# EAGLE design Control Board (EAGLE 7.7.0)
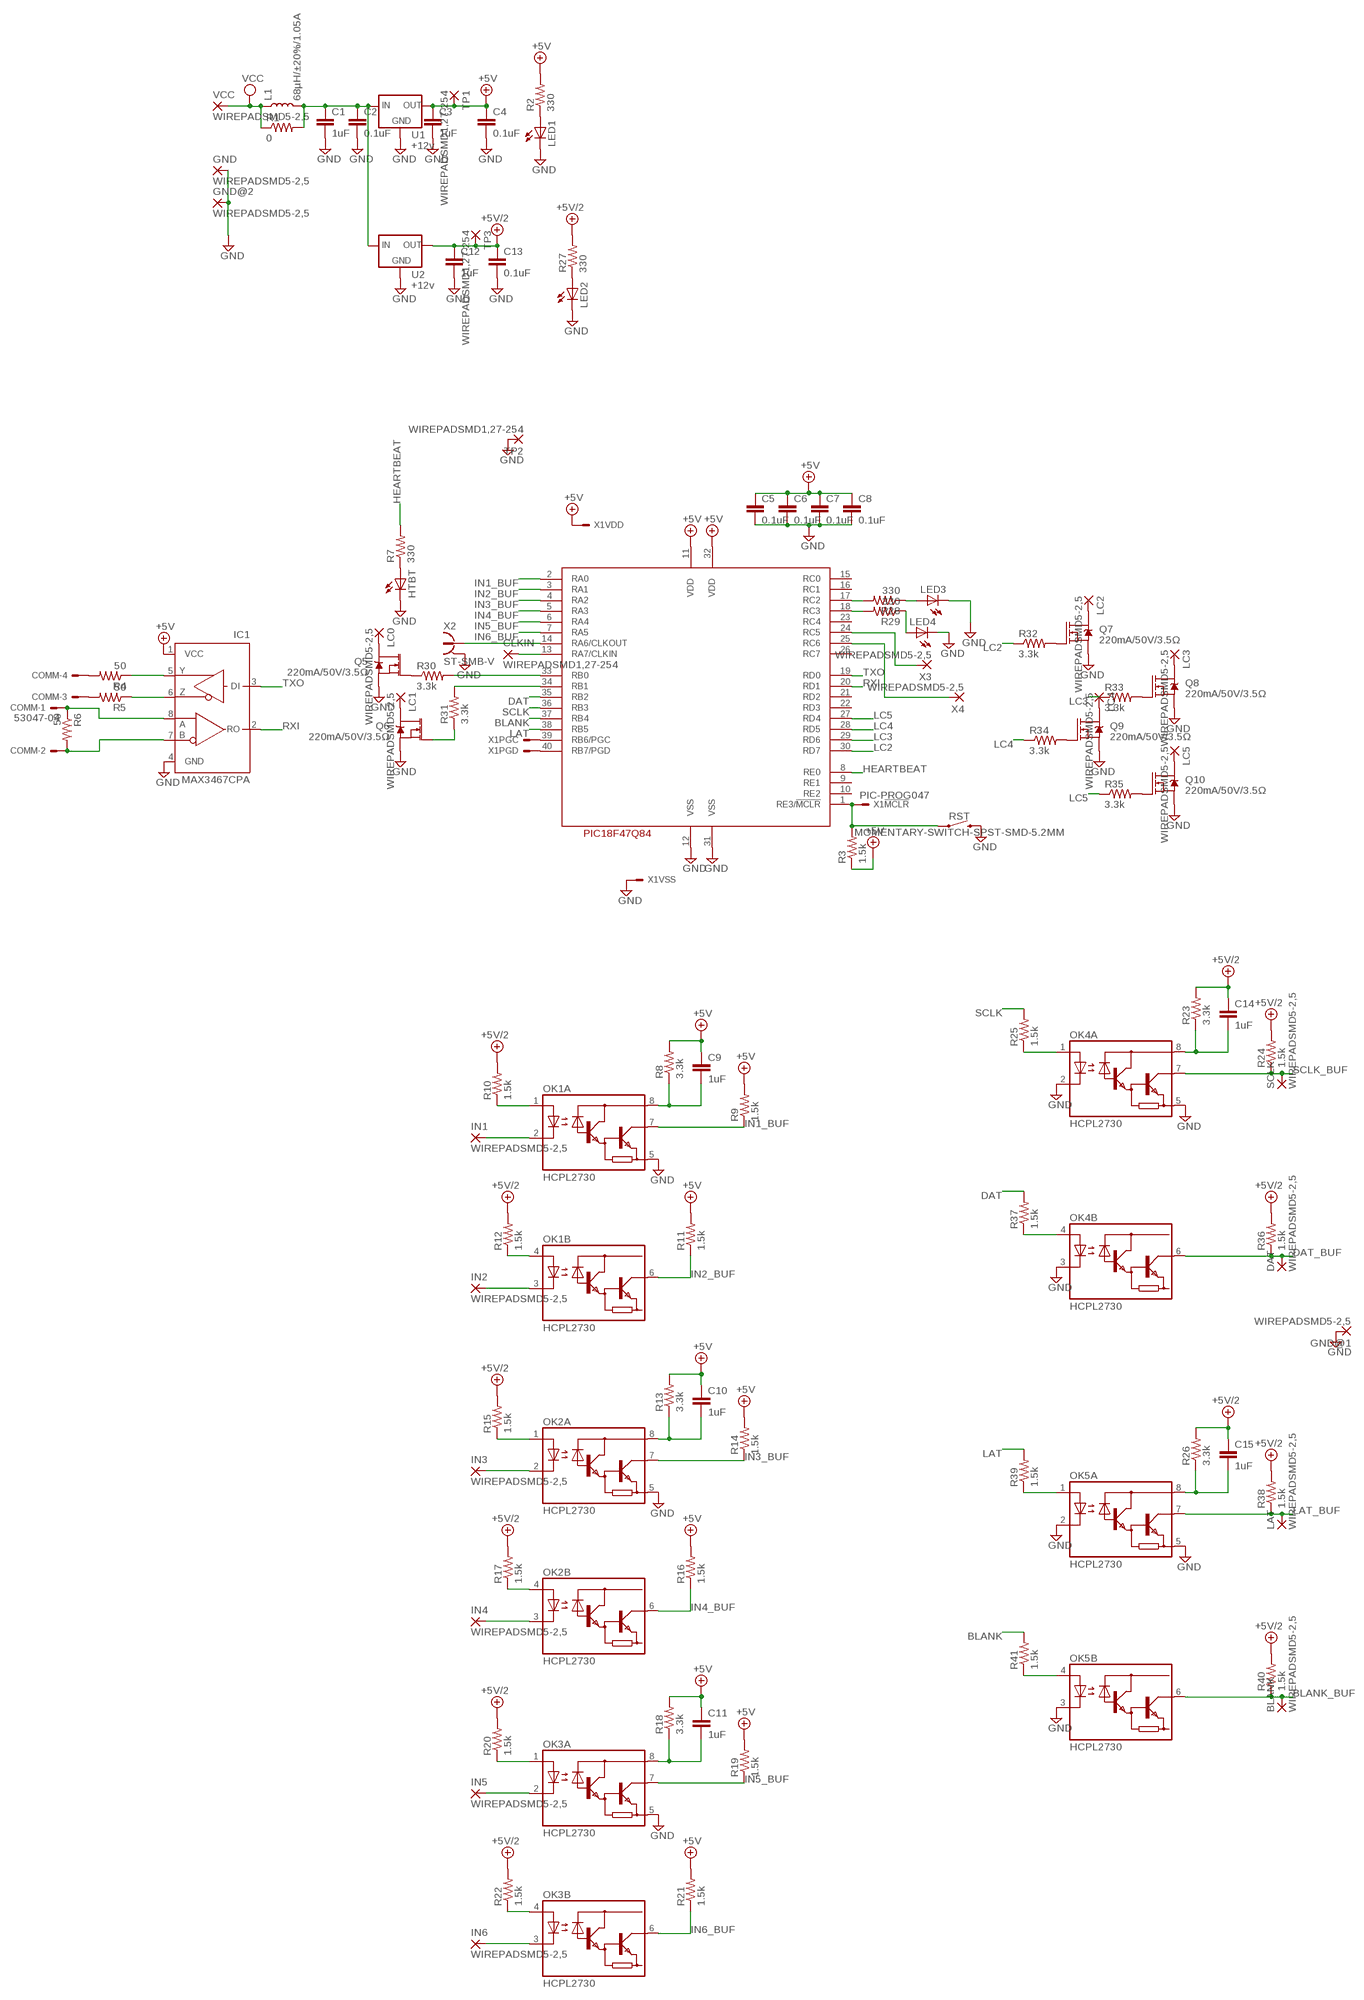
[diagram p0: schematic, sheet 1]

## Parts
BLANK  WIREPADSMD5-2,5  [5-2,5]
C1  1uF  C-EUC1206  [C1206]
C2  0.1uF  C-EUC1206  [C1206]
C3  1uF  C-EUC1206  [C1206]
C4  0.1uF  C-EUC1206  [C1206]
C5  0.1uF  C-EUC1206  [C1206]
C6  0.1uF  C-EUC1206  [C1206]
C7  0.1uF  C-EUC1206  [C1206]
C8  0.1uF  C-EUC1206  [C1206]
C9  1uF  C-EUC1206  [C1206]
C10  1uF  C-EUC1206  [C1206]
C11  1uF  C-EUC1206  [C1206]
C12  1uF  C-EUC1206  [C1206]
C13  0.1uF  C-EUC1206  [C1206]
C14  1uF  C-EUC1206  [C1206]
C15  1uF  C-EUC1206  [C1206]
CLKIN  WIREPADSMD1,27-254  [SMD1,27-2,54]
COMM  53047-04  [53047-04]
DAT  WIREPADSMD5-2,5  [5-2,5]
GND  WIREPADSMD5-2,5  [5-2,5]
GND@1  WIREPADSMD5-2,5  [5-2,5]
GND@2  WIREPADSMD5-2,5  [5-2,5]
HTBT  LEDCHIPLED_1206  [CHIPLED_1206]
IC1  MAX3467CPA  [SO08]
IN1  WIREPADSMD5-2,5  [5-2,5]
IN2  WIREPADSMD5-2,5  [5-2,5]
IN3  WIREPADSMD5-2,5  [5-2,5]
IN4  WIREPADSMD5-2,5  [5-2,5]
IN5  WIREPADSMD5-2,5  [5-2,5]
IN6  WIREPADSMD5-2,5  [5-2,5]
L1  68µH/±20%/1.05A  INDUCTOR-CR75-68UH  [CR75]
LAT  WIREPADSMD5-2,5  [5-2,5]
LC0  WIREPADSMD5-2,5  [5-2,5]
LC1  WIREPADSMD5-2,5  [5-2,5]
LC2  WIREPADSMD5-2,5  [5-2,5]
LC3  WIREPADSMD5-2,5  [5-2,5]
LC4  WIREPADSMD5-2,5  [5-2,5]
LC5  WIREPADSMD5-2,5  [5-2,5]
LED1  LEDCHIPLED_1206  [CHIPLED_1206]
LED2  LEDCHIPLED_1206  [CHIPLED_1206]
LED3  LEDCHIPLED_1206  [CHIPLED_1206]
LED4  LEDCHIPLED_1206  [CHIPLED_1206]
OK1  HCPL2730  [DIL08]
OK2  HCPL2730  [DIL08]
OK3  HCPL2730  [DIL08]
OK4  HCPL2730  [DIL08]
OK5  HCPL2730  [DIL08]
Q5  220mA/50V/3.5Ω  MOSFET-NCH-BSS138  [SOT23-3]
Q6  220mA/50V/3.5Ω  MOSFET-NCH-BSS138  [SOT23-3]
Q7  220mA/50V/3.5Ω  MOSFET-NCH-BSS138  [SOT23-3]
Q8  220mA/50V/3.5Ω  MOSFET-NCH-BSS138  [SOT23-3]
Q9  220mA/50V/3.5Ω  MOSFET-NCH-BSS138  [SOT23-3]
Q10  220mA/50V/3.5Ω  MOSFET-NCH-BSS138  [SOT23-3]
R1  0  R-US_M1206  [M1206]
R2  330  R-US_M1206  [M1206]
R3  1.5k  R-US_M1206  [M1206]
R4  50  R-US_M1206  [M1206]
R5  50  R-US_M1206  [M1206]
R6  50  R-US_M1206  [M1206]
R7  330  R-US_M1206  [M1206]
R8  3.3k  R-US_M1206  [M1206]
R9  1.5k  R-US_M1206  [M1206]
R10  1.5k  R-US_M1206  [M1206]
R11  1.5k  R-US_M1206  [M1206]
R12  1.5k  R-US_M1206  [M1206]
R13  3.3k  R-US_M1206  [M1206]
R14  1.5k  R-US_M1206  [M1206]
R15  1.5k  R-US_M1206  [M1206]
R16  1.5k  R-US_M1206  [M1206]
R17  1.5k  R-US_M1206  [M1206]
R18  3.3k  R-US_M1206  [M1206]
R19  1.5k  R-US_M1206  [M1206]
R20  1.5k  R-US_M1206  [M1206]
R21  1.5k  R-US_M1206  [M1206]
R22  1.5k  R-US_M1206  [M1206]
R23  3.3k  R-US_M1206  [M1206]
R24  1.5k  R-US_M1206  [M1206]
R25  1.5k  R-US_M1206  [M1206]
R26  3.3k  R-US_M1206  [M1206]
R27  330  R-US_M1206  [M1206]
R28  330  R-US_M1206  [M1206]
R29  330  R-US_M1206  [M1206]
R30  3.3k  R-US_M1206  [M1206]
R31  3.3k  R-US_M1206  [M1206]
R32  3.3k  R-US_M1206  [M1206]
R33  3.3k  R-US_M1206  [M1206]
R34  3.3k  R-US_M1206  [M1206]
R35  3.3k  R-US_M1206  [M1206]
R36  1.5k  R-US_M1206  [M1206]
R37  1.5k  R-US_M1206  [M1206]
R38  1.5k  R-US_M1206  [M1206]
R39  1.5k  R-US_M1206  [M1206]
R40  1.5k  R-US_M1206  [M1206]
R41  1.5k  R-US_M1206  [M1206]
RST  MOMENTARY-SWITCH-SPST-SMD-5.2MM  [TACTILE_SWITCH_SMD_5.2MM]
SCLK  WIREPADSMD5-2,5  [5-2,5]
TP1  WIREPADSMD1,27-254  [SMD1,27-2,54]
TP2  WIREPADSMD1,27-254  [SMD1,27-2,54]
TP3  WIREPADSMD1,27-254  [SMD1,27-2,54]
U1  +12v  V_REG_78XX7812  [TO-252]
U2  +12v  V_REG_78XX7812  [TO-252]
U$1  PIC18F47Q84  [DIL40]
VCC  WIREPADSMD5-2,5  [5-2,5]
X1  PIC-PROG047  [53047-05]
X2  ST-SMB-V  [ST-SMB-V]
X3  WIREPADSMD5-2,5  [5-2,5]
X4  WIREPADSMD5-2,5  [5-2,5]

## Nets
+5V: C3.1 C4.1 C5.1 C6.1 C7.1 C8.1 C9.1 C10.1 C11.1 IC1.1(VCC) R2.2 R3.1 R8.2 R9.2 R11.2 R13.2 R14.2 R16.2 R18.2 R19.2 R21.2 TP1.1(P) U1.2(OUT) U$1.11(VDD) U$1.32(VDD) X1.2
+5V/2: C12.1 C13.1 C14.1 C15.1 R10.2 R12.2 R15.2 R17.2 R20.2 R22.2 R23.2 R24.2 R26.2 R27.2 R36.2 R38.2 R40.2 TP3.1(P) U2.2(OUT)
BLANK: R41.2 U$1.37(RB4)
BLANK_BUF: BLANK.1(P) OK5.6(B:VO2) R40.1
DAT: R37.2 U$1.35(RB2)
DAT_BUF: DAT.1(P) OK4.6(B:VO2) R36.1
GND: C1.2 C2.2 C3.2 C4.2 C5.2 C6.2 C7.2 C8.2 C12.2 C13.2 GND.1(P) GND@1.1(P) GND@2.1(P) HTBT.C IC1.4(GND) LED1.C LED2.C LED3.C LED4.C OK1.5(A:GND) OK2.5(A:GND) OK3.5(A:GND) OK4.2(A:C1) OK4.3(B:C2) OK4.5(A:GND) OK5.2(A:C1) OK5.3(B:C2) OK5.5(A:GND) Q5.2(S) Q6.2(S) Q7.2(S) Q8.2(S) Q9.2(S) Q10.2(S) RST.3 TP2.1(P) U1.3(GND) U2.3(GND) U$1.12(VSS) U$1.31(VSS) X1.3 X2.2 X2.3 X2.4 X2.5
HEARTBEAT: R7.2 U$1.8(RE0)
IN1: IN1.1(P) OK1.2(A:C1)
IN1_BUF: OK1.7(A:VO1) R9.1 U$1.2(RA0)
IN2: IN2.1(P) OK1.3(B:C2)
IN2_BUF: OK1.6(B:VO2) R11.1 U$1.3(RA1)
IN3: IN3.1(P) OK2.2(A:C1)
IN3_BUF: OK2.7(A:VO1) R14.1 U$1.4(RA2)
IN4: IN4.1(P) OK2.3(B:C2)
IN4_BUF: OK2.6(B:VO2) R16.1 U$1.5(RA3)
IN5: IN5.1(P) OK3.2(A:C1)
IN5_BUF: OK3.7(A:VO1) R19.1 U$1.6(RA4)
IN6: IN6.1(P) OK3.3(B:C2)
IN6_BUF: OK3.6(B:VO2) R21.1 U$1.7(RA5)
LAT: R39.2 U$1.38(RB5)
LAT_BUF: LAT.1(P) OK5.7(A:VO1) R38.1
LC2: R32.1 U$1.30(RD7)
LC3: R33.1 U$1.29(RD6)
LC4: R34.1 U$1.28(RD5)
LC5: R35.1 U$1.27(RD4)
N$1: C1.1 C2.1 L1.P$2 R1.2 U1.1(IN) U2.1(IN)
N$2: LED1.A R2.1
N$3: R3.2 RST.1 U$1.1(RE3/!MCLR) X1.1
N$4: U$1.40(RB7/PGD) X1.4
N$5: U$1.39(RB6/PGC) X1.5
N$6: U$1.14(RA6/CLKOUT) X2.1
N$7: IC1.5(Y) R4.1
N$8: IC1.6(Z) R5.1
N$9: COMM.1 IC1.8(A) R6.1
N$10: COMM.2 IC1.7(B) R6.2
N$11: COMM.4 R4.2
N$12: COMM.3 R5.2
N$13: HTBT.A R7.1
N$14: CLKIN.1(P) U$1.13(RA7/CLKIN)
N$15: C9.2 OK1.8(A:VCC) R8.1
N$16: C10.2 OK2.8(A:VCC) R13.1
N$17: OK2.1(A:A1) R15.1
N$18: OK1.1(A:A1) R10.1
N$19: OK2.4(B:A2) R17.1
N$20: OK1.4(B:A2) R12.1
N$21: C11.2 OK3.8(A:VCC) R18.1
N$22: OK3.1(A:A1) R20.1
N$23: OK3.4(B:A2) R22.1
N$24: C14.2 OK4.8(A:VCC) R23.1
N$25: OK4.1(A:A1) R25.1
N$26: C15.2 OK5.8(A:VCC) R26.1
N$27: OK4.4(B:A2) R37.1
N$28: OK5.1(A:A1) R39.1
N$29: LED2.A R27.1
N$30: OK5.4(B:A2) R41.1
N$33: R28.2 U$1.17(RC2)
N$34: R29.2 U$1.18(RC3)
N$35: LED3.A R28.1
N$36: LED4.A R29.1
N$37: R30.2 U$1.33(RB0)
N$38: R31.2 U$1.34(RB1)
N$39: Q5.1(G) R30.1
N$40: Q6.1(G) R31.1
N$41: LC0.1(P) Q5.3(D)
N$42: LC1.1(P) Q6.3(D)
N$43: Q7.1(G) R32.2
N$44: Q8.1(G) R33.2
N$45: Q9.1(G) R34.2
N$46: Q10.1(G) R35.2
N$47: LC2.1(P) Q7.3(D)
N$48: LC3.1(P) Q8.3(D)
N$49: LC4.1(P) Q9.3(D)
N$50: LC5.1(P) Q10.3(D)
N$51: U$1.25(RC6) X4.1(P)
N$52: U$1.24(RC5) X3.1(P)
RXI: IC1.2(RO) U$1.20(RD1)
SCLK: R25.2 U$1.36(RB3)
SCLK_BUF: OK4.7(A:VO1) R24.1 SCLK.1(P)
TXO: IC1.3(DI) U$1.19(RD0)
VCC: L1.P$1 R1.1 VCC.1(P)
Unconnected: U$1.9(RE1) U$1.10(RE2) U$1.15(RC0) U$1.16(RC1) U$1.21(RD2) U$1.22(RD3) U$1.23(RC4) U$1.26(RC7)

## Library data of the parts
BLANK CLKIN DAT GND GND@1 GND@2 IN1-IN6 LAT LC0 LC1-LC5 SCLK TP1-TP3 VCC X3 X4 = wirepad:WIREPAD: Wire PAD connect wire on PCB
C1-C15 = resistor:C-EU: CAPACITOR, European symbol
COMM = con-molex:53?-04: CONNECTOR wire to board 1.25 mm (.049 inch) pitch header; MF: WALDOM/MOLEX; MPN: 53047-0410; OC_FARNELL: 9733060; OC_NEWARK: 38C9900
HTBT LED1-LED4 = led:LED: LED OSRAM: - CHIPLED LG R971, LG N971, LY N971, LG Q971, LY Q971, LO R971, LY R971 LH N974, LH R974 LS Q976, LO Q976, LY Q976 LO Q996 - Hyper CHIPLED LW Q18S LB Q993, LB Q99A, LB R99A - SideLED LS A670, LO A670, LY A670, LG A670, LP A670 LB A673, LV A673, LT A673, LW A673 LH A674 LY A675 LS A676, LA A676, LO A676, LY A676, LW A676 LS A679, LY A679, LG A679 - Hyper Micro SIDELED® LS Y876, LA Y876, LO Y876, LY Y876 LT Y87S - SmartLED LW L88C, LW L88S LB L89C, LB L89S, LG L890 LS L89K, LO L89K, LY L89K LS L896, LA L896, LO L896, LY L896 - TOPLED LS T670, LO T670, LY T670, LG T670, LP T670 LSG T670, LSP T670, LSY T670, LOP T670, LYG T670 LG T671, LOG T671, LSG T671 LB T673, LV T673, LT T673, LW T673 LH T674 LS T676, LA T676, LO T676, LY T676, LB T676, LH T676, LSB T676, LW T676 LB T67C, LV T67C, LT T67C, LS T67K, LO T67K, LY T67K, LW E67C LS E67B, LA E67B, LO E67B, LY E67B, LB E67C, LV E67C, LT E67C LW T67C LS T679, LY T679, LG T679 LS T770, LO T770, LY T770, LG T770, LP T770 LB T773, LV T773, LT T773, LW T773 LH T774 LS E675, LA E675, LY E675, LS T675 LS T776, LA T776, LO T776, LY T776, LB T776 LHGB T686 LT T68C, LB T68C - Hyper Mini TOPLED® LB M676 - Mini TOPLED Santana® LG M470 LS M47K, LO M47K, LY M47K Source: http://www.osram.convergy.de LUXEON: - LUMILED® LXK2-PW12-R00, LXK2-PW12-S00, LXK2-PW14-U00, LXK2-PW14-V00 LXK2-PM12-R00, LXK2-PM12-S00, LXK2-PM14-U00 LXK2-PE12-Q00, LXK2-PE12-R00, LXK2-PE12-S00, LXK2-PE14-T00, LXK2-PE14-U00 LXK2-PB12-K00, LXK2-PB12-L00, LXK2-PB12-M00, LXK2-PB14-N00, LXK2-PB14-P00, LXK2-PB14-Q00 LXK2-PR12-L00, LXK2-PR12-M00, LXK2-PR14-Q00, LXK2-PR14-R00 LXK2-PD12-Q00, LXK2-PD12-R00, LXK2-PD12-S00 LXK2-PH12-R00, LXK2-PH12-S00 LXK2-PL12-P00, LXK2-PL12-Q00, LXK2-PL12-R00 Source: www.luxeon.com KINGBRIGHT: KA-3528ASYC Source: www.kingbright.com
IC1 = maxim:MAX3467*: +5V, Fail-Safe, 40Mbps, Profibus RS-485/RS-422 Transceivers Source: MAX3465-MAX3469.pdf; OC_FARNELL: unknown; OC_NEWARK: unknown
L1 = SparkFun-Coils:INDUCTOR: Inductors Resist changes in electrical current. Basically a coil of wire. SparkFun Products: SparkFun Load Cell Amplifier - HX711 <https://www.sparkfun.com/products/13879> IOIO-OTG - V2.2 <https://www.sparkfun.com/products/13613>; PROD_ID: NDUC-09739
OK1-OK5 = optocoupler:HCPL2730: HEWLETT PACKARD OPTO COUPLER; MF: AGILENT TECHNOLOGIES; MPN: HCPL-2730-000E; OC_FARNELL: 9994840; OC_NEWARK: 88H7816
Q5-Q10 = SparkFun-DiscreteSemi:MOSFET-NCH: N-channel MOSFETs Voltage controlled devices that allow control of high current outputs. SparkFun Products: SparkFun OpenScale <https://www.sparkfun.com/products/13261> SparkFun Digital Sandbox <https://www.sparkfun.com/products/12651> SparkFun Monster Moto Shield <https://www.sparkfun.com/products/10182> SparkFun MOSFET Power Controller <https://www.sparkfun.com/products/11214>; PROD_ID: TRANS-00830
R1-R41 = resistor:R-US_: RESISTOR, American symbol
RST = SparkFun-Switches:MOMENTARY-SWITCH-SPST: Momentary Switch (Pushbutton) - SPST Normally-open (NO) SPST momentary switches (buttons, pushbuttons). Variants PTH-12MM - 12mm square, through-hole Momentary Pushbutton Switch - 12mm Square <https://www.sparkfun.com/products/9190> (COM-09190) PTH-6.0MM, PTH-6.0MM-KIT - 6.0mm square, through-hole Mini Pushbutton Switch <https://www.sparkfun.com/products/97> (COM-00097) KIT package intended for soldering kit's - only one side of pads' copper is exposed. PTH-RIGHT-ANGLE-KIT - Right-angle, through-hole Right Angle Tactile Button <https://www.sparkfun.com/products/10791> - Used on SparkFun BigTime Watch Kit <https://www.sparkfun.com/products/11734> SMD-12MM - 12mm square, surface-mount Tactile Button - SMD (12mm) <https://www.sparkfun.com/products/12993> (COM-12993) Used on SparkFun PicoBoard <https://www.sparkfun.com/products/11888> SMD-4.5MM - 4.5mm Square Trackball Switch Used on SparkFun Blackberry Trackballer Breakout <https://www.sparkfun.com/products/13169> SMD-4.6MMX2.8MM - 4.60mm x 2.80mm, surface mount Used on SparkFun SAMD21 Mini Breakout <https://www.sparkfun.com/products/13664> SMD-5.2MM, SMD-5.2-REDUNDANT - 5.2mm square, surface-mount Mini Pushbutton Switch - SMD <https://www.sparkfun.com/products/8720> (COM-08720) Used on Arduino Pro Mini <https://www.sparkfun.com/products/11114> REDUNDANT package connects both switch circuits together SMD-6.0X3.5MM - 6.0 x 3.5mm, surface mount Momentary Reset Switch SMD <https://www.sparkfun.com/products/8229> (COM-08229) SMD-6.2MM-TALL - 6.2mm square, surface mount Tactile Button - SMD (6mm) <https://www.sparkfun.com/products/12992> Used on SparkFun Digital Sandbox <https://www.sparkfun.com/products/12651> SMD-RIGHT-ANGLE - Right-angle, surface mount Used on SparkFun Block for Intel® Edison - Arduino <https://www.sparkfun.com/products/13036>; PROD_ID: SWCH-08247; SF_SKU: COM-08720
U1 U2 = SparkFun-IC-Power:V_REG_78XX: Voltage Regulator Standard 78xx regulator. IGO (Input Ground Output). Spark Fun Electronics SKU : COM-00107; PROD_ID: VREG-12370
U$1 = FRC696:PIC18F47Q84
X1 = FRC696:PIC-PROG: CONNECTOR wire to board 1.25 mm (.049 inch) pitch header; MF: MOLEX; MPN: 53047-0510; OC_FARNELL: 9732861; OC_NEWARK: 38C9901
X2 = con-coax:ST-SMB-V: MALE SMB CONNECTOR Radiall distributor RS 193-8855G7; OC_FARNELL: unknown; OC_NEWARK: unknown

## Board
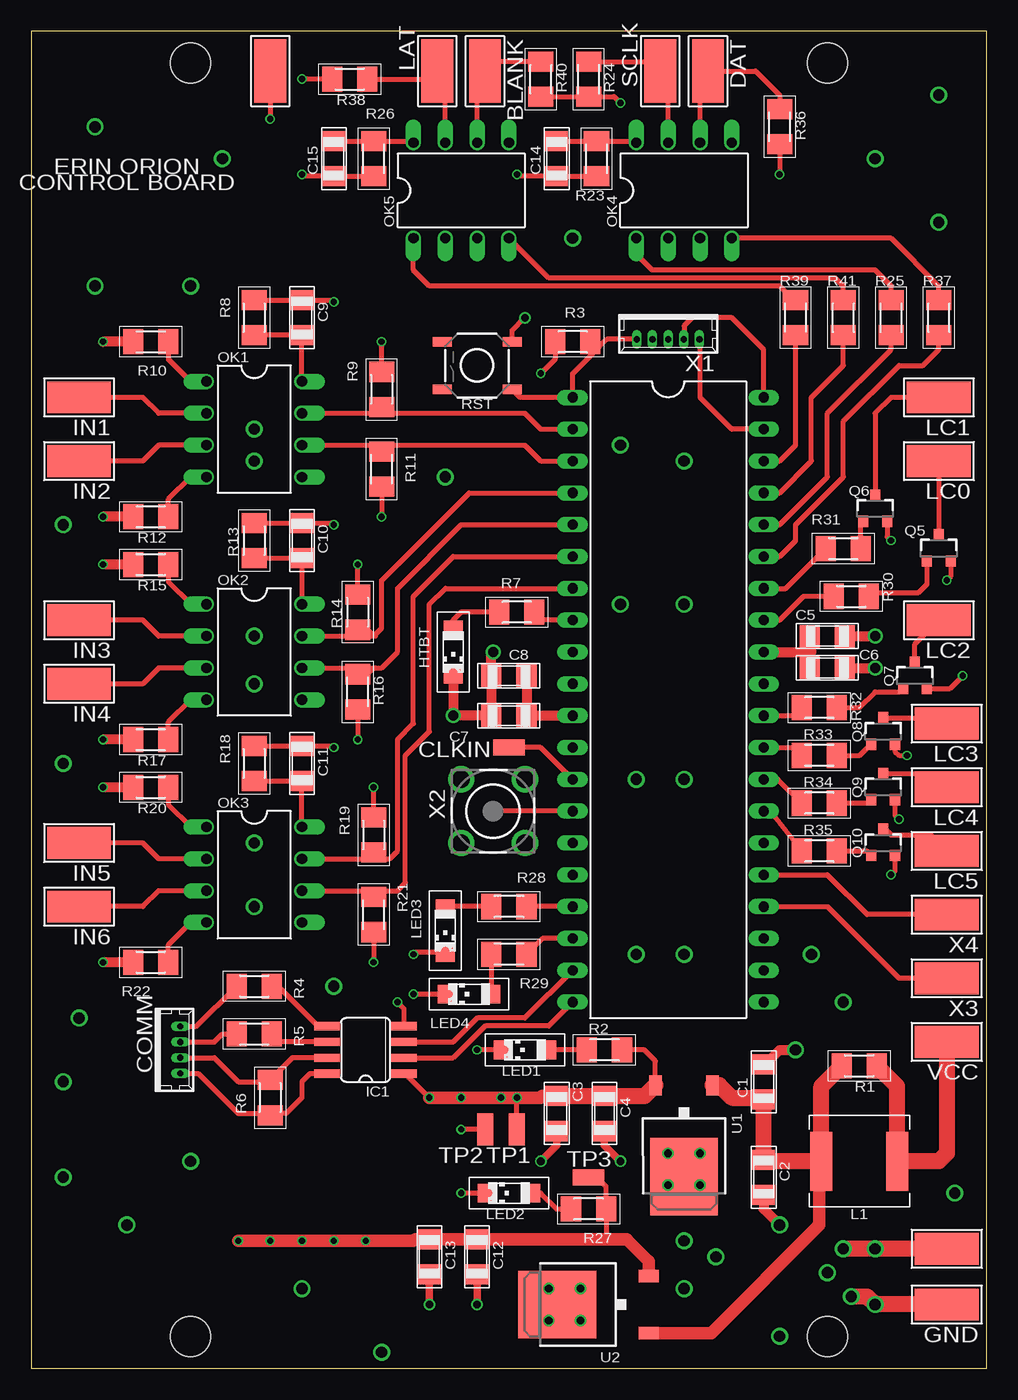
[diagram p1: board, top side]
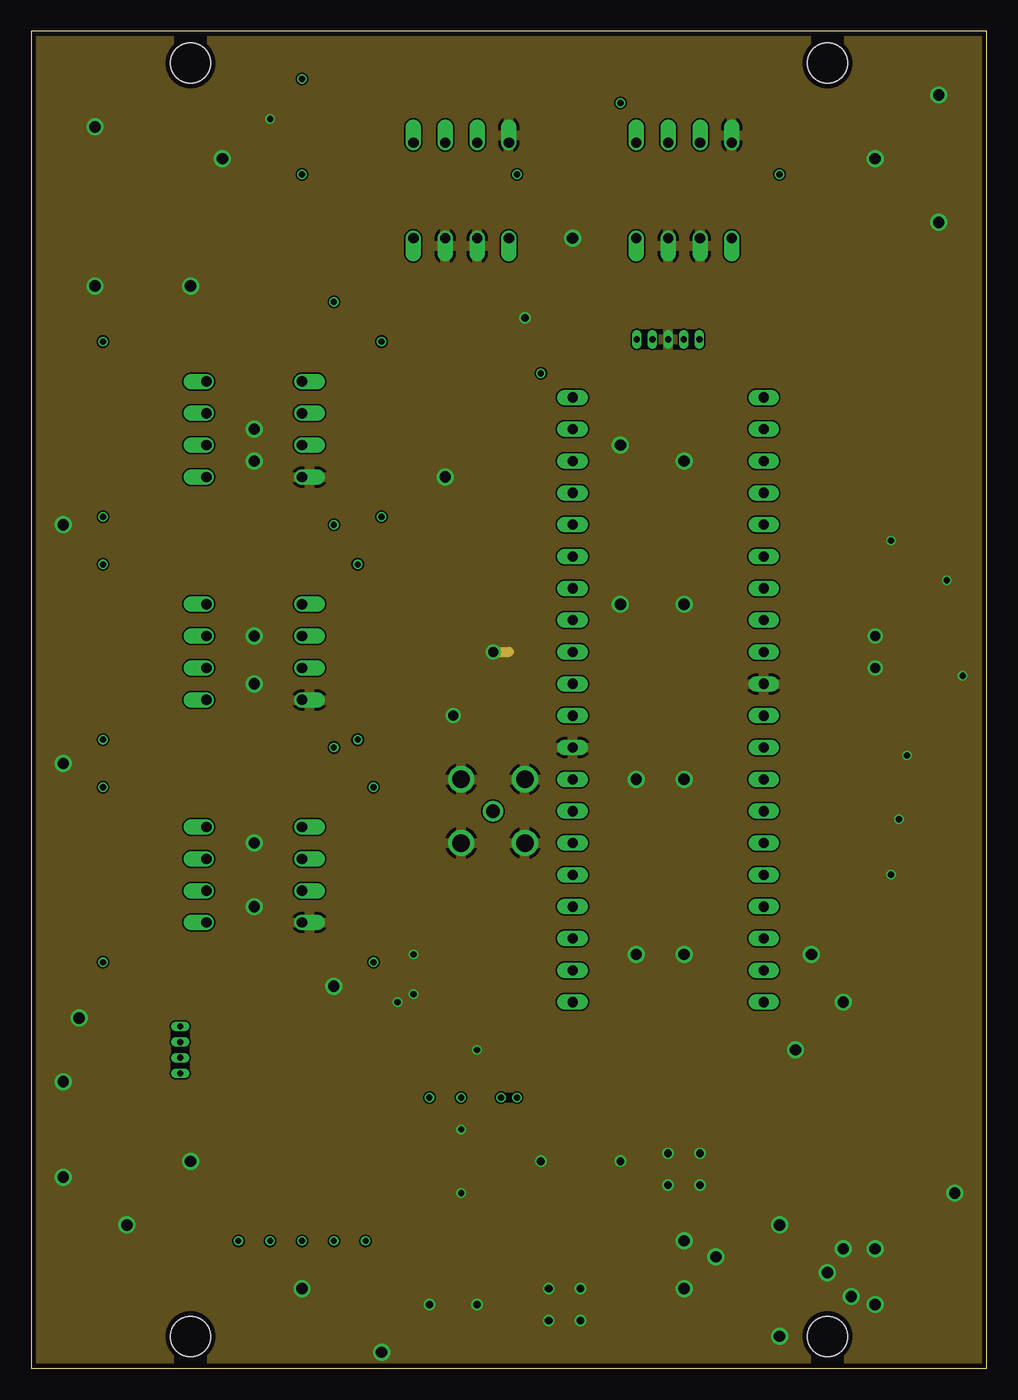
[diagram p2: board, inner layer Route2]
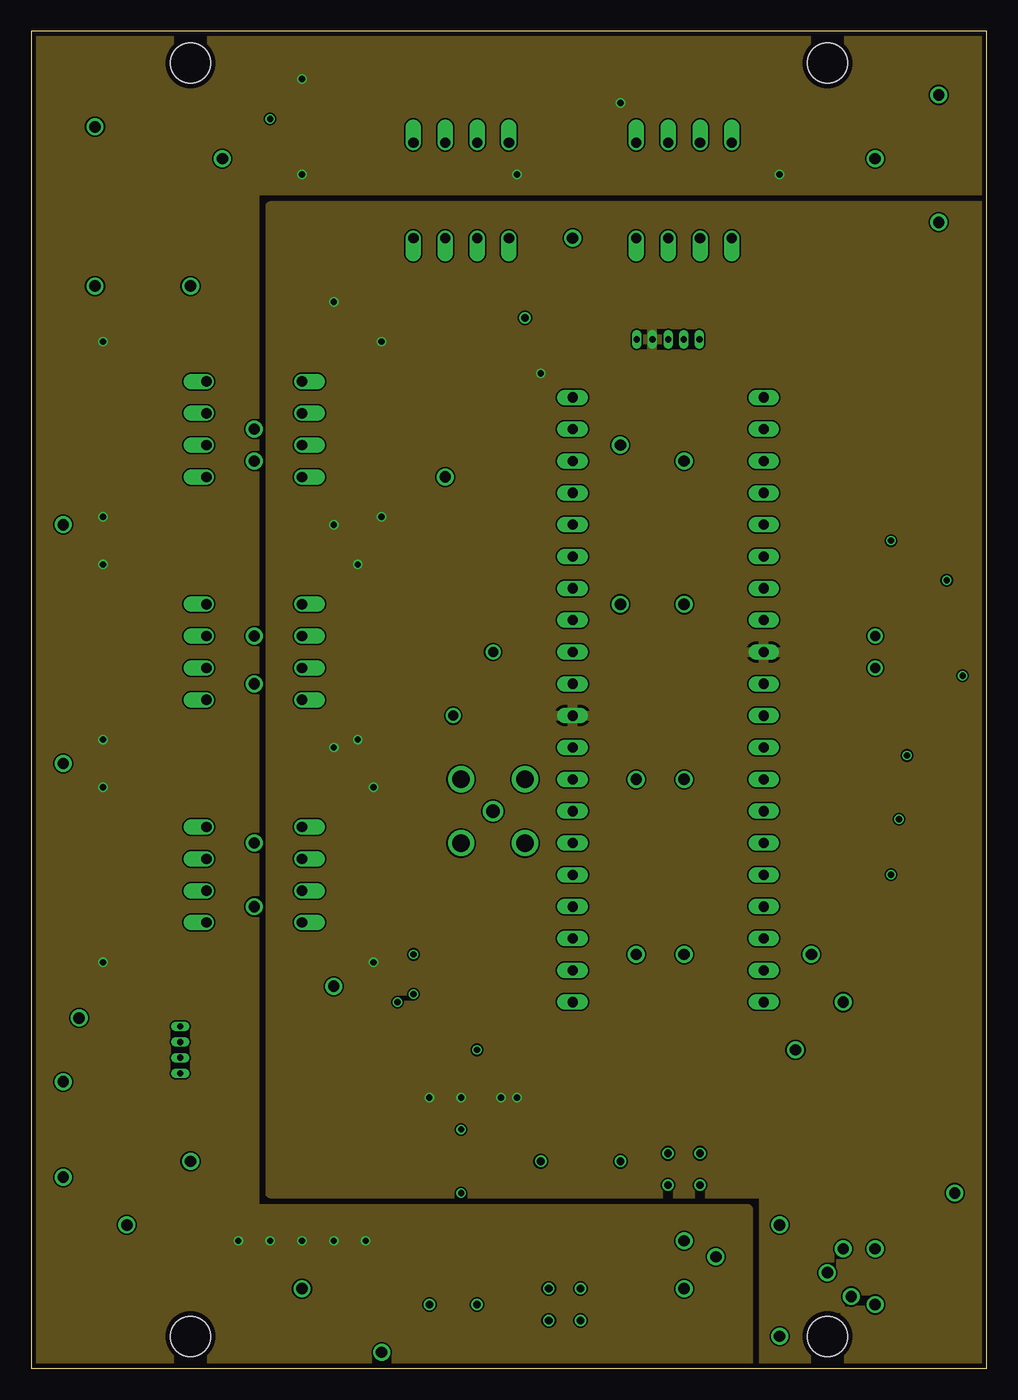
[diagram p3: board, inner layer Route15]
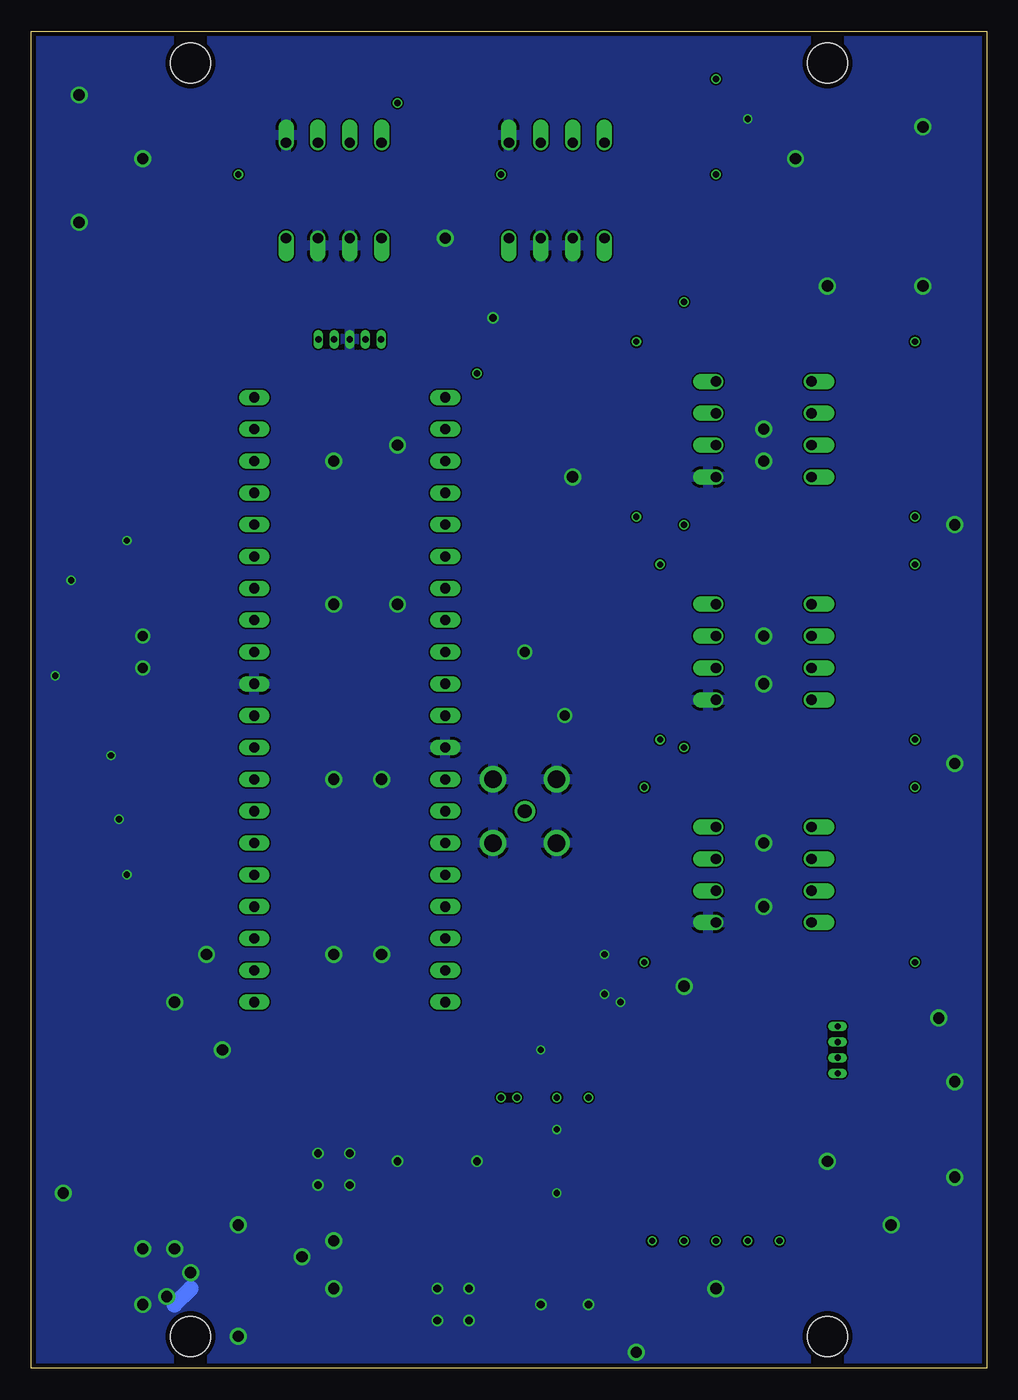
[diagram p4: board, bottom side, seen from below]

Size 76.2 x 106.68 mm. Coordinates in mm from the lower left corner, seen from the top.
Outline: 0,0 76.2,0 76.2,106.68 0,106.68 0,0
Copper layers (1*2*15*16): Top 0.035559375mm / dielectric 0.17018125mm / Route2 0.01778125mm / dielectric 47mil / Route15 0.01778125mm / dielectric 0.17018125mm / Bottom 0.035559375mm
Design rules "oshpark-4layer": minimum track width 5mil, minimum drill 10mil, track to track 5mil, track to pad 5mil, pad to pad 5mil, via to via 5mil, smd to smd 5mil, copper to edge 15mil, drill to drill 6mil, minimum pad ring 4mil, minimum via ring 4mil, stop-mask expansion 1.5mil, vias tented up to drill 0mil, thermal gap 10mil
Holes 3.2 mm at 12.7,2.54 63.5,2.54 12.7,104.14 63.5,104.14

### Footprints (pad centres in the part's own frame; a part is rotated, then mirrored left to right if it is on the bottom)
5-2,5 = smd 2.54 x 5.08: 1 0,0
C1206 = smd 1.6 x 1.8: 1 -1.4,0; 2 1.4,0
SMD1,27-2,54 = smd 1.27 x 2.54: 1 0,0
53047-04 = drill 0.5 pad 0.698 long: 1 1.875,0.45; 2 0.625,0.45; 3 -0.625,0.45; 4 -1.875,0.45
CHIPLED_1206 = smd 1.5 x 1.5: A 0,-1.75; C 0,1.75
SO08 = smd 0.66 x 2.032: 1 -1.905,-3.073; 2 -0.635,-3.073; 3 0.635,-3.073; 4 1.905,-3.073; 5 1.905,3.073; 6 0.635,3.073; 7 -0.635,3.073; 8 -1.905,3.073
CR75 = smd 1.75 x 4.7: P$1 -3.025,0; P$2 3.025,0
DIL08 = drill 0.813 offset: 1 -3.81,-3.81; 2 -1.27,-3.81; 3 1.27,-3.81; 4 3.81,-3.81; 5 3.81,3.81; 6 1.27,3.81; 7 -1.27,3.81; 8 -3.81,3.81
SOT23-3 = smd 0.8 x 0.9: 1 -0.95,-1; 2 0.95,-1; 3 0,1.1
M1206 = smd 1.6 x 2: 1 -1.4,0; 2 1.4,0
TACTILE_SWITCH_SMD_5.2MM = smd 1.524 x 0.762: 1 -2.794,1.905; 2 2.794,1.905; 3 -2.794,-1.905; 4 2.794,-1.905
TO-252 = smd 1 x 1.6: 1 -2.28,-4.8; 2 2.28,-4.8 | smd 5.4 x 6.2: 3 0,2.5
DIL40 = drill 0.813 long: 1 -24.13,-7.62; 2 -21.59,-7.62; 3 -19.05,-7.62; 4 -16.51,-7.62; 5 -13.97,-7.62; 6 -11.43,-7.62; 7 -8.89,-7.62; 8 -6.35,-7.62; 9 -3.81,-7.62; 10 -1.27,-7.62; 11 1.27,-7.62; 12 3.81,-7.62; 13 6.35,-7.62; 14 8.89,-7.62; 15 11.43,-7.62; 16 13.97,-7.62; 17 16.51,-7.62; 18 19.05,-7.62; 19 21.59,-7.62; 20 24.13,-7.62; 21 24.13,7.62; 22 21.59,7.62; 23 19.05,7.62; 24 16.51,7.62; 25 13.97,7.62; 26 11.43,7.62; 27 8.89,7.62; 28 6.35,7.62; 29 3.81,7.62; 30 1.27,7.62; 31 -1.27,7.62; 32 -3.81,7.62; 33 -6.35,7.62; 34 -8.89,7.62; 35 -11.43,7.62; 36 -13.97,7.62; 37 -16.51,7.62; 38 -19.05,7.62; 39 -21.59,7.62; 40 -24.13,7.62
53047-05 = drill 0.5 pad 0.698 long: 1 2.5,0.45; 2 1.25,0.45; 3 0,0.45; 4 -1.25,0.45; 5 -2.5,0.45
ST-SMB-V = drill 1.1: 1 0,0 | drill 1.4: 2 -2.54,2.54; 3 2.54,2.54; 4 2.54,-2.54; 5 -2.54,-2.54

### Placement (x,y rotation side)
BLANK  36.2,103.5 0 top
C1  58.42,22.86 90 top
C2  58.42,15.24 270 top
C3  41.91,20.32 270 top
C4  45.72,20.32 270 top
C5  63.5,58.42 0 top
C6  63.5,55.88 0 top
C7  38.1,52.07 180 top
C8  38.1,55.24 180 top
C9  21.59,83.82 270 top
C10  21.59,66.04 270 top
C11  21.59,48.26 270 top
C12  35.56,8.89 270 top
C13  31.75,8.89 270 top
C14  41.91,96.52 90 top
C15  24.13,96.52 90 top
CLKIN  38.1,49.53 90 top
COMM  11.43,25.4 270 top
DAT  53.98,103.5 0 top
GND  73.03,9.53 90 top
GND@1  19.05,103.5 0 top
GND@2  73.03,5.08 90 top
HTBT  33.66,57.15 180 top
IC1  26.67,25.4 90 top
IN1  3.81,77.47 90 top
IN2  3.81,72.39 90 top
IN3  3.81,59.69 90 top
IN4  3.81,54.61 90 top
IN5  3.81,41.91 90 top
IN6  3.81,36.83 90 top
L1  66.04,16.51 180 top
LAT  32.38,103.5 0 top
LC0  72.39,72.39 90 top
LC1  72.39,77.47 90 top
LC2  72.39,59.69 90 top
LC3  73.03,51.44 90 top
LC4  73.03,46.35 90 top
LC5  73.03,41.27 90 top
LED1  39.37,25.4 90 top
LED2  38.1,13.97 90 top
LED3  33.02,34.92 180 top
LED4  34.92,29.84 90 top
OK1  17.78,74.93 270 top
OK2  17.78,57.15 270 top
OK3  17.78,39.37 270 top
OK4  52.07,93.98 0 top
OK5  34.29,93.98 0 top
Q5  72.39,65.41 0 top
Q6  67.31,68.58 0 top
Q7  70.48,55.24 0 top
Q8  67.94,50.8 0 top
Q9  67.94,46.35 0 top
Q10  67.94,41.91 0 top
R1  66.04,24.13 180 top
R2  45.72,25.4 0 top
R3  43.18,81.92 0 top
R4  17.78,30.48 180 top
R5  17.78,26.67 180 top
R6  19.05,21.59 90 top
R7  38.73,60.33 0 top
R8  17.78,83.82 90 top
R9  27.94,78.11 90 top
R10  9.53,81.92 180 top
R11  27.94,71.75 270 top
R12  9.53,67.94 180 top
R13  17.78,66.04 90 top
R14  26.04,60.33 90 top
R15  9.53,64.14 180 top
R16  26.04,53.98 270 top
R17  9.53,50.16 180 top
R18  17.78,48.26 90 top
R19  27.3,42.55 90 top
R20  9.53,46.35 180 top
R21  27.3,36.2 270 top
R22  9.53,32.38 180 top
R23  45.09,96.52 270 top
R24  44.45,102.87 270 top
R25  68.58,83.82 270 top
R26  27.3,96.52 270 top
R27  44.45,12.7 0 top
R28  38.1,36.83 0 top
R29  38.1,33.02 0 top
R30  65.41,61.59 180 top
R31  64.77,65.41 180 top
R32  62.87,52.7 0 top
R33  62.87,48.9 0 top
R34  62.87,45.09 0 top
R35  62.87,41.27 0 top
R36  59.69,99.06 270 top
R37  72.39,83.82 270 top
R38  25.4,102.87 180 top
R39  60.96,83.82 270 top
R40  40.64,102.87 270 top
R41  64.77,83.82 270 top
RST  35.56,80.01 180 top
SCLK  50.16,103.5 0 top
TP1  38.73,19.05 0 top
TP2  36.2,19.05 0 top
TP3  44.45,15.24 90 top
U1  52.07,17.78 180 top
U2  44.45,5.08 90 top
U$1  50.8,53.34 270 top
VCC  73.03,26.04 90 top
X1  50.8,82.55 180 top
X2  36.83,44.45 0 top
X3  73.03,31.11 90 top
X4  73.03,36.2 90 top

### Tracks (layer width: path | path; a pad name or v marks a point on that pad's centre or on a via)
+5V  (via drill 0.5)
  Top 0.406: R18.2 C11.1 24,49.66 v24.13,49.53 | R13.2 C10.1 24,67.44 v24.13,67.31 | TP1.1 v38.73,21.59 | IC1.1 29.84,23.5 v31.75,21.59 | R21.2 v27.3,32.38 | R16.2 v26.04,50.16 | R19.2 v27.3,46.35 | R14.2 v26.04,64.14 | R11.2 v27.94,67.94 | R9.2 v27.94,81.92 | R8.2 C9.1 24,85.22 v24.13,85.09 | U1.2 49.79,24.5 48.9,25.4 R2.2 | R3.1 41.78,80.52 v40.64,79.38
  Top 0.813: U$1.11 C7.1 C8.1 | U$1.32 62.23,57.15 | C5.1 62.1,57.28 62.23,57.15 | C6.1 62.1,57.02 62.23,57.15
  Top 1.016: C3.1 40.77,21.72 40.64,21.59 v38.73,21.59 v37.47,21.59 v34.29,21.59 v31.75,21.59
  Top 1.27: C3.1 C4.1 48.93,21.72 U1.2
  pour Route15: 19.05,92.71 19.05,13.97 58.42,13.97 58.42,-5.08 83.82,-5.08 82.55,92.71
+5V/2  (via drill 0.5)
  Top 0.406: 45.72,10.29 45.85,10.42 R27.2 45.85,14.47 45.09,15.24 TP3.1 | R38.2 v21.59,102.87 | R26.2 C15.1 21.72,95.12 v21.59,95.25 | R23.2 C14.1 38.87,95.12 v38.73,95.25 | R40.2 R24.2 46.48,101.47 v46.99,100.97 | R36.2 v59.69,95.25
  Top 0.813: R10.2 v5.71,81.92 | R12.2 v5.71,67.94 | R15.2 v5.71,64.14 | R17.2 v5.71,50.16 | R20.2 v5.71,46.35 | R22.2 v5.71,32.38
  Top 1.016: U2.2 49.25,8.54 47.49,10.29 45.72,10.29 C12.1 C13.1 30.61,10.29 30.48,10.16 v26.67,10.16 v24.13,10.16 v21.59,10.16 v19.05,10.16 v16.51,10.16
  pour Route15: -7.62,111.76 82.55,111.76 82.55,93.98 17.78,93.98 17.78,12.7 57.15,12.7 57.15,-5.08 -7.62,-5.08
BLANK
  Top 0.406: U$1.37 59.69,69.85 62.23,72.39 62.23,77.47 64.77,80.01 R41.2
BLANK_BUF
  Top 0.406: OK5.6 35.56,102.87 BLANK.1 36.96,104.27 R40.1
DAT
  Top 0.406: U$1.35 59.69,64.77 60.96,66.04 60.96,67.31 64.77,71.12 64.77,75.56 69.22,80.01 71.12,80.01 72.39,81.28 R37.2
DAT_BUF
  Top 0.406: OK4.6 53.34,102.87 DAT.1 57.78,103.5 59.69,101.6 R36.1
GND  (via drill 0.5, 0.61, 0.8, 0.9)
  Top 0.406: IC1.4 29.74,28.68 v29.21,29.21 | LED1.C v35.56,25.4 | TP2.1 v34.29,19.05 | LED2.C v34.29,13.97 | RST.3 38.35,82.8 v39.37,83.82 | LED3.C 30.64,33.17 v30.48,33.02 | LED4.C v30.48,29.84 | U2.3 41.95,4.49 v41.27,3.81 | U1.3 51.48,15.28 v50.8,14.61 | Q6.2 68.26,66.36 v68.58,66.04 | Q5.2 73.34,63.18 v73.03,62.87 | Q7.2 73.3,54.24 v74.3,55.24 | Q8.2 68.89,49.22 69.22,48.9 v69.85,48.9 | Q9.2 68.89,44.13 v69.22,43.81 | Q10.2 68.89,39.69 v68.58,39.37 | GND@1.1 v19.05,99.69
  Top 0.61: C3.2 41.91,17.78 v40.64,16.51 | C4.2 45.72,17.78 v46.99,16.51 | C12.2 v35.56,5.08 | C13.2 v31.75,5.08
  Top 0.813: C7.2 v33.66,52.07 HTBT.C | v36.83,57.15 36.7,57.02 C8.2 36.7,52.2 36.83,52.07 | C5.2 v67.31,58.42 | C6.2 v67.31,55.88 | C2.2 58.42,12.7 v59.69,11.43 | C1.2 58.55,24.26 59.69,25.4 v60.96,25.4
  Top 1.27: GND.1 v67.31,9.53 v64.77,9.53 | GND@2.1 v67.31,5.08 66.67,5.71 v65.41,5.71
  Route2 0.813: v36.83,57.15 38.1,57.15
  Bottom 1.27: 64.77,5.08 63.5,6.35
  other vias: 50.8,17.14 53.34,17.14 53.34,14.61 43.81,6.35 43.81,3.81 41.27,6.35 7.62,11.43 27.94,1.27 21.59,6.35 12.7,16.51 52.07,10.16 54.61,8.89 52.07,6.35 59.69,2.54 63.5,7.62 73.66,13.97 64.77,29.21 24.13,30.48 17.78,41.91 17.78,36.83 3.81,27.94 48.26,33.02 52.07,33.02 52.07,46.99 48.26,46.99 46.99,60.96 52.07,60.96 52.07,72.39 46.99,73.66 33.02,71.12 17.78,58.42 17.78,54.61 17.78,74.93 17.78,72.39 12.7,86.36 5.08,86.36 5.08,99.06 15.24,96.52 72.39,101.6 67.31,96.52 72.39,91.44 43.18,90.17 62.23,33.02 2.54,67.31 2.54,48.26 2.54,22.86 2.54,15.24
  pour Bottom: -7.62,113.03 86.36,113.03 86.36,-7.62 -7.62,-7.62
  pour Route2: -2.54,109.22 78.74,109.22 78.74,-2.54 -2.54,-2.54
HEARTBEAT
  Top 0.406: U$1.8 40.77,59.69 R7.2
IN1
  Top 0.406: OK1.2 10.16,76.2 8.89,77.47 IN1.1
IN1_BUF
  Top 0.406: OK1.7 27.43,76.2 R9.1 28.07,76.7 28.57,76.2 39.37,76.2 40.64,74.93 U$1.2
IN2
  Top 0.406: OK1.3 10.16,73.66 8.89,72.39 IN2.1
IN2_BUF
  Top 0.406: OK1.6 27.43,73.66 R11.1 28.07,73.16 28.57,73.66 39.37,73.66 40.64,72.39 U$1.3
IN3
  Top 0.406: OK2.2 10.16,58.42 8.89,59.69 IN3.1
IN3_BUF
  Top 0.406: OK2.7 27.3,58.42 | 27.3,58.42 26.8,58.92 R14.1 27.43,58.42 27.3,58.42 | 27.3,58.42 27.94,59.05 27.94,62.87 34.92,69.85 U$1.4
IN4
  Top 0.406: OK2.3 10.16,55.88 8.89,54.61 IN4.1
IN4_BUF
  Top 0.406: OK2.6 27.3,55.88 | 27.3,55.88 27.43,55.88 | 27.43,55.88 R16.1 26.8,55.38 27.3,55.88 | 27.43,55.88 27.94,55.88 29.21,57.15 29.21,62.23 34.29,67.31 U$1.5
IN5
  Top 0.406: OK3.2 10.16,40.64 8.89,41.91 IN5.1
IN5_BUF
  Top 0.406: OK3.7 26.8,40.64 R19.1 27.43,41.15 27.94,40.64 28.57,40.64 29.21,41.27 29.21,50.16 30.48,51.44 30.48,61.59 33.66,64.77 U$1.6
IN6
  Top 0.406: OK3.3 10.16,38.1 8.89,36.83 IN6.1
IN6_BUF
  Top 0.406: OK3.6 26.8,38.1 | 26.8,38.1 R21.1 | 26.8,38.1 29.21,38.1 29.84,38.73 29.84,48.9 31.75,50.8 31.75,60.96 33.02,62.23 U$1.7
LAT
  Top 0.406: U$1.38 59.69,72.39 60.96,73.66 R39.2
LAT_BUF
  Top 0.406: OK5.7 33.02,102.87 | 33.02,102.87 LAT.1 | R38.1 33.02,102.87
LC2
  Top 0.406: U$1.30 60.83,52.07 R32.1
LC3
  Top 0.406: U$1.29 61.47,49.53 R33.1
LC4
  Top 0.406: U$1.28 59.56,46.99 R34.1
LC5
  Top 0.406: U$1.27 58.92,44.45 R35.1
N$1
  Top 1.016: U2.1 54.23,2.8 62.87,11.43 62.87,16.36 L1.P$2
  Top 1.27: R1.2 63.02,22.5 L1.P$2 58.55,16.51 C2.1 C1.1 58.29,21.59 55.88,21.59 54.89,22.58 U1.1
N$2
  Top 0.406: R2.1 LED1.A
N$3
  Top 0.406: 44.77,80.96 43.18,79.38 U$1.1 38.99,77.47 RST.1 | 44.77,80.96 45.91,82.1 X1.1 | R3.2 44.58,81.15 44.77,80.96
N$4
  Top 0.406: U$1.40 58.42,81.28 55.88,83.82 52.7,83.82 52.07,83.19 52.07,82.12 X1.4
N$5
  Top 0.406: U$1.39 55.88,74.93 53.34,77.47 53.34,82.06 X1.5
N$6
  Top 0.406: U$1.14 X2.1
N$7
  Top 0.406: IC1.5 22.86,27.3 19.68,30.48 R4.1
N$8
  Top 0.406: IC1.6 19.82,26.04 R5.1
N$9
  Top 0.406: IC1.8 22.23,23.5 21.59,22.86 21.59,21.59 20.32,20.32 19.18,20.32 R6.1 18.92,20.32 16.51,20.32 13.3,23.52 COMM.1
N$10
  Top 0.406: IC1.7 20.82,24.77 R6.2 18.92,22.86 16.51,22.86 14.6,24.77 COMM.2
N$11
  Top 0.406: COMM.4 13.18,27.27 R4.2
N$12
  Top 0.406: COMM.3 14.6,26.02 15.24,26.67 R5.2
N$13
  Top 0.406: R7.1 34.29,60.33 33.66,59.69 HTBT.A
N$14
  Top 0.406: U$1.13 40.64,49.53 CLKIN.1
N$15
  Top 0.406: OK1.8 C9.2 R8.1
N$16
  Top 0.406: R13.1 C10.2 OK2.8
N$17
  Top 0.406: OK2.1 12.7,60.96 10.93,62.73 R15.1
N$18
  Top 0.406: OK1.1 12.7,78.74 10.93,80.52 R10.1
N$19
  Top 0.406: OK2.4 12.7,53.34 10.93,51.56 R17.1
N$20
  Top 0.406: OK1.4 12.7,71.12 10.93,69.34 R12.1
N$21
  Top 0.406: R18.1 C11.2 OK3.8
N$22
  Top 0.406: OK3.1 12.7,43.18 10.93,44.95 R20.1
N$23
  Top 0.406: OK3.4 12.7,35.56 10.93,33.78 R22.1
N$24
  Top 0.406: C14.2 R23.1 48.13,97.92 OK4.8
N$25
  Top 0.406: R25.1 68.58,86.36 67.31,87.63 49.53,87.63 48.26,88.9 OK4.1
N$26
  Top 0.406: C15.2 R26.1 30.35,97.92 OK5.8
N$27
  Top 0.406: R37.1 72.39,86.36 68.58,90.17 OK4.4
N$28
  Top 0.406: R39.1 60.83,85.22 59.69,86.36 31.75,86.36 30.48,87.63 OK5.1
N$29
  Top 0.406: LED2.A 40.64,13.97 41.91,12.7 R27.1
N$30
  Top 0.406: R41.1 64.77,86.36 64.14,87 41.27,87 OK5.4
N$33
  Top 0.406: U$1.17 R28.2
N$34
  Top 0.406: U$1.18 40.77,34.29 R29.2
N$35
  Top 0.406: R28.1 33.17,36.83 LED3.A
N$36
  Top 0.406: R29.1 36.7,29.87 LED4.A
N$37
  Top 0.406: U$1.33 59.69,59.69 61.59,61.59 R30.2
N$38
  Top 0.406: U$1.34 60.2,62.23 R31.2
N$39
  Top 0.406: R30.1 67.12,61.91 70.8,61.91 71.44,62.55 Q5.1
N$40
  Top 0.406: R31.1 66.17,67.39 Q6.1
N$41
  Top 0.406: LC0.1 Q5.3
N$42
  Top 0.406: LC1.1 68.58,77.47 67.31,76.2 Q6.3
N$43
  Top 0.406: R32.2 66.04,52.7 67.31,53.98 69.27,53.98 Q7.1
N$44
  Top 0.406: R33.2 66.09,48.9 Q8.1
N$45
  Top 0.406: R34.2 66.72,45.09 Q9.1
N$46
  Top 0.406: R35.2 66.63,41.27 Q10.1
N$47
  Top 0.406: Q7.3 70.48,57.78 LC2.1
N$48
  Top 0.406: Q8.3 72.56,51.9 LC3.1
N$49
  Top 0.406: Q9.3 72.56,47.45 LC4.1
N$50
  Top 0.406: Q10.3 68.11,43.01 68.58,42.55 71.75,42.55 LC5.1
N$51
  Top 0.406: U$1.25 63.5,39.37 66.67,36.2 X4.1
N$52
  Top 0.406: U$1.24 63.5,36.83 69.22,31.11 X3.1
RXI
  Top 0.406: IC1.2 33.66,24.77 36.2,27.3 41.27,27.3 U$1.20
SCLK
  Top 0.406: U$1.36 59.69,67.31 63.5,71.12 63.5,76.2 68.58,81.28 R25.2
SCLK_BUF
  Top 0.406: OK4.7 50.8,102.87 SCLK.1 49.4,104.27 R24.1
TXO
  Top 0.406: IC1.3 33.66,26.04 35.56,27.94 39.37,27.94 U$1.19
VCC
  Top 1.27: R1.1 69.06,22.5 L1.P$1 72.39,16.51 73.03,17.14 VCC.1

### Text on the board
tPlace: ERIN ORION | CONTROL BOARD